# Altium schematic sheet Flash.SchDoc: Flash memory
size A4; Author: Michał Gumiela; DocumentNumber: 1; SheetNumber: 1; SheetTotal: 16; Model: EM1; PageSetup: Record=PageOptions|CenterHorizontal=True|CenterVertical=True|PrintScale=0.52|XCorrection=1.00|YCorrection=1.00|PrintKind=1|BorderSize=5000000|LeftOffset=0|BottomOffset=0|Orientation=2|PaperLength=4200|PaperWidth=2970|Scale=100|PaperSource=7|PrintQuality=600|MediaType=1|DitherType=10|PaperKind=A3|PrintScaleMode=1
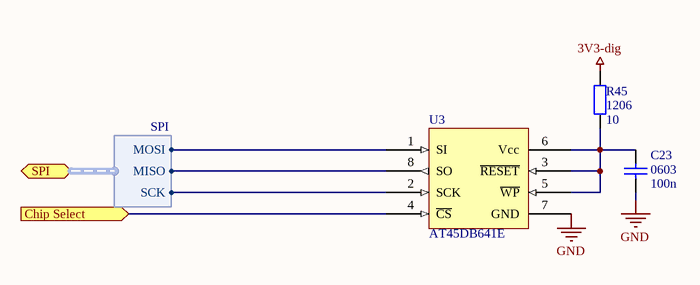
[diagram p0: Flash.SchDoc]

## Parts
C23  0603  value 100n  [SMD_Capacitor_0603]
R45  1206  value 10  [SMD_Resistor_1206]
U3  AT45DB641E  [SOIC-8-N]

## Ports
Chip Select (in), SPI (harness SPI)

## Harnesses
SPI: MOSI, MISO, SCK

## Nets
3V3-dig: R45.1
GND: C23.1 U3.7(GND)
Chip Select: U3.4(~{CS}) ; port Chip Select
NetC23_2: C23.2 R45.2 U3.3(~{RESET}) U3.5(~{WP}) U3.6(Vcc)
NetU3_1: U3.1(SI) ; port SPI.MOSI
NetU3_2: U3.2(SCK) ; port SPI.SCK
NetU3_8: U3.8(SO) ; port SPI.MISO

## Notes on the sheet
- Title:
- Sheet:
- of
- Author:
- Model:
- Document Number:
- Checked by:
- Iss-Rev:
- Approved by:
- Date:
- File name:

## Library data of the parts
C23 = Cap1: Capacitor; Published: 8-Jun-2000; LatestRevisionDate: 17-Jul-2002; LatestRevisionNote: Re-released for DXP Platform.; PackageReference: RAD-0.3; Publisher: Altium Limited; PackageDescription: Radial Cap, Thru-Hole; 2 Leads; 0.3 in Pin Spacing
R45 = Res2: Resistor; Published: 8-Jun-2000; LatestRevisionDate: 17-Jul-2002; LatestRevisionNote: Re-released for DXP Platform.; PackageReference: AXIAL-0.4; Publisher: Altium Limited; PackageDescription: Axial Device, Thru-Hole; 2 Leads; 0.4 in Pin Spacing
U3 = AT45DB641E: 64-Mbit DataFlash (with Extra 2-Mbits)